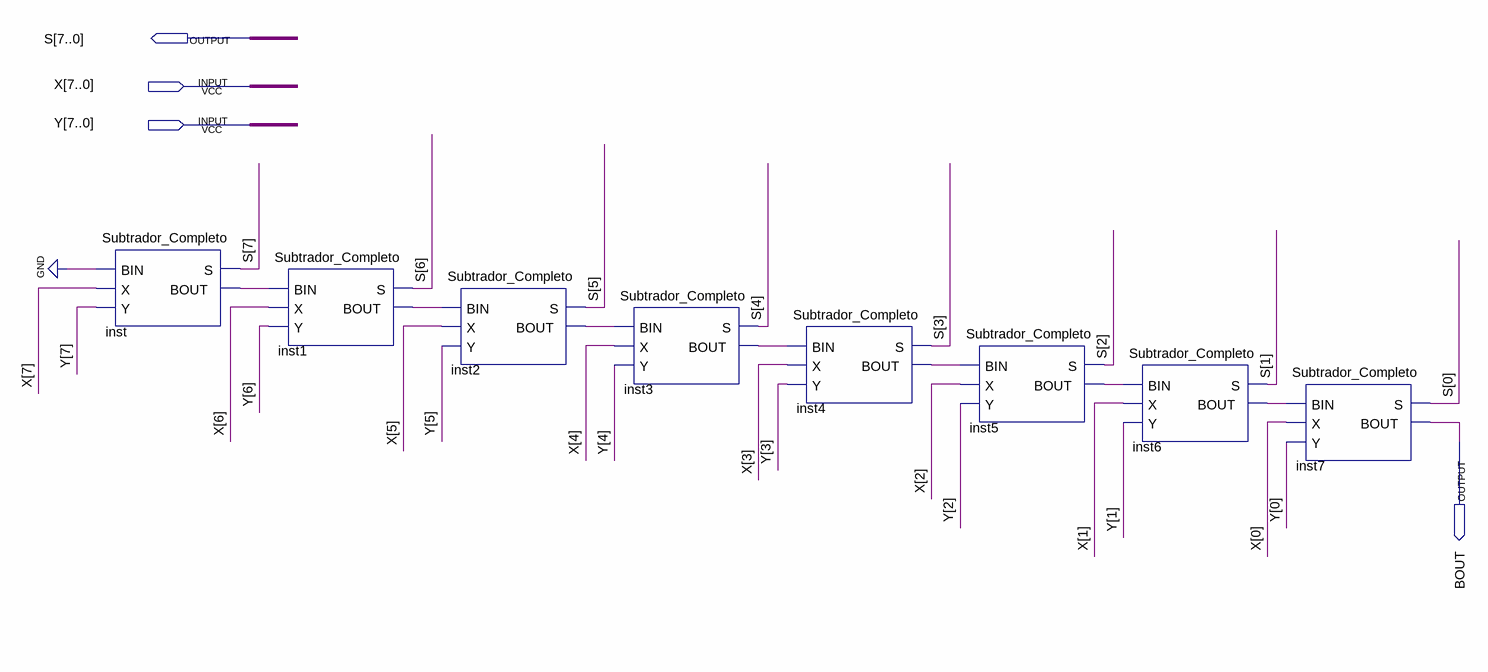
[diagram p0: schematic sheet]
// Quartus schematic Subtrador_Final.bdf as structural Verilog: 8 symbols, 4 pins
module Subtrador_Final (
  input  [7:0] X,
  input  [7:0] Y,
  output [7:0] S,
  output BOUT
);

  wire inst1_bout, inst2_bout, inst3_bout, inst4_bout, inst5_bout, inst6_bout, inst_bout;

  Subtrador_Completo inst (.BIN(1'b0), .X(X[7]), .Y(Y[7]), .S(S[7]), .BOUT(inst_bout));
  Subtrador_Completo inst1 (.BIN(inst_bout), .X(X[6]), .Y(Y[6]), .S(S[6]), .BOUT(inst1_bout));
  Subtrador_Completo inst2 (.BIN(inst1_bout), .X(X[5]), .Y(Y[5]), .S(S[5]), .BOUT(inst2_bout));
  Subtrador_Completo inst3 (.BIN(inst2_bout), .X(X[4]), .Y(Y[4]), .S(S[4]), .BOUT(inst3_bout));
  Subtrador_Completo inst4 (.BIN(inst3_bout), .X(X[3]), .Y(Y[3]), .S(S[3]), .BOUT(inst4_bout));
  Subtrador_Completo inst5 (.BIN(inst4_bout), .X(X[2]), .Y(Y[2]), .S(S[2]), .BOUT(inst5_bout));
  Subtrador_Completo inst6 (.BIN(inst5_bout), .X(X[1]), .Y(Y[1]), .S(S[1]), .BOUT(inst6_bout));
  Subtrador_Completo inst7 (.BIN(inst6_bout), .X(X[0]), .Y(Y[0]), .S(S[0]), .BOUT(BOUT));
endmodule
